# Altium project Phantom_Platform.PrjPcb (part 1 of 2)
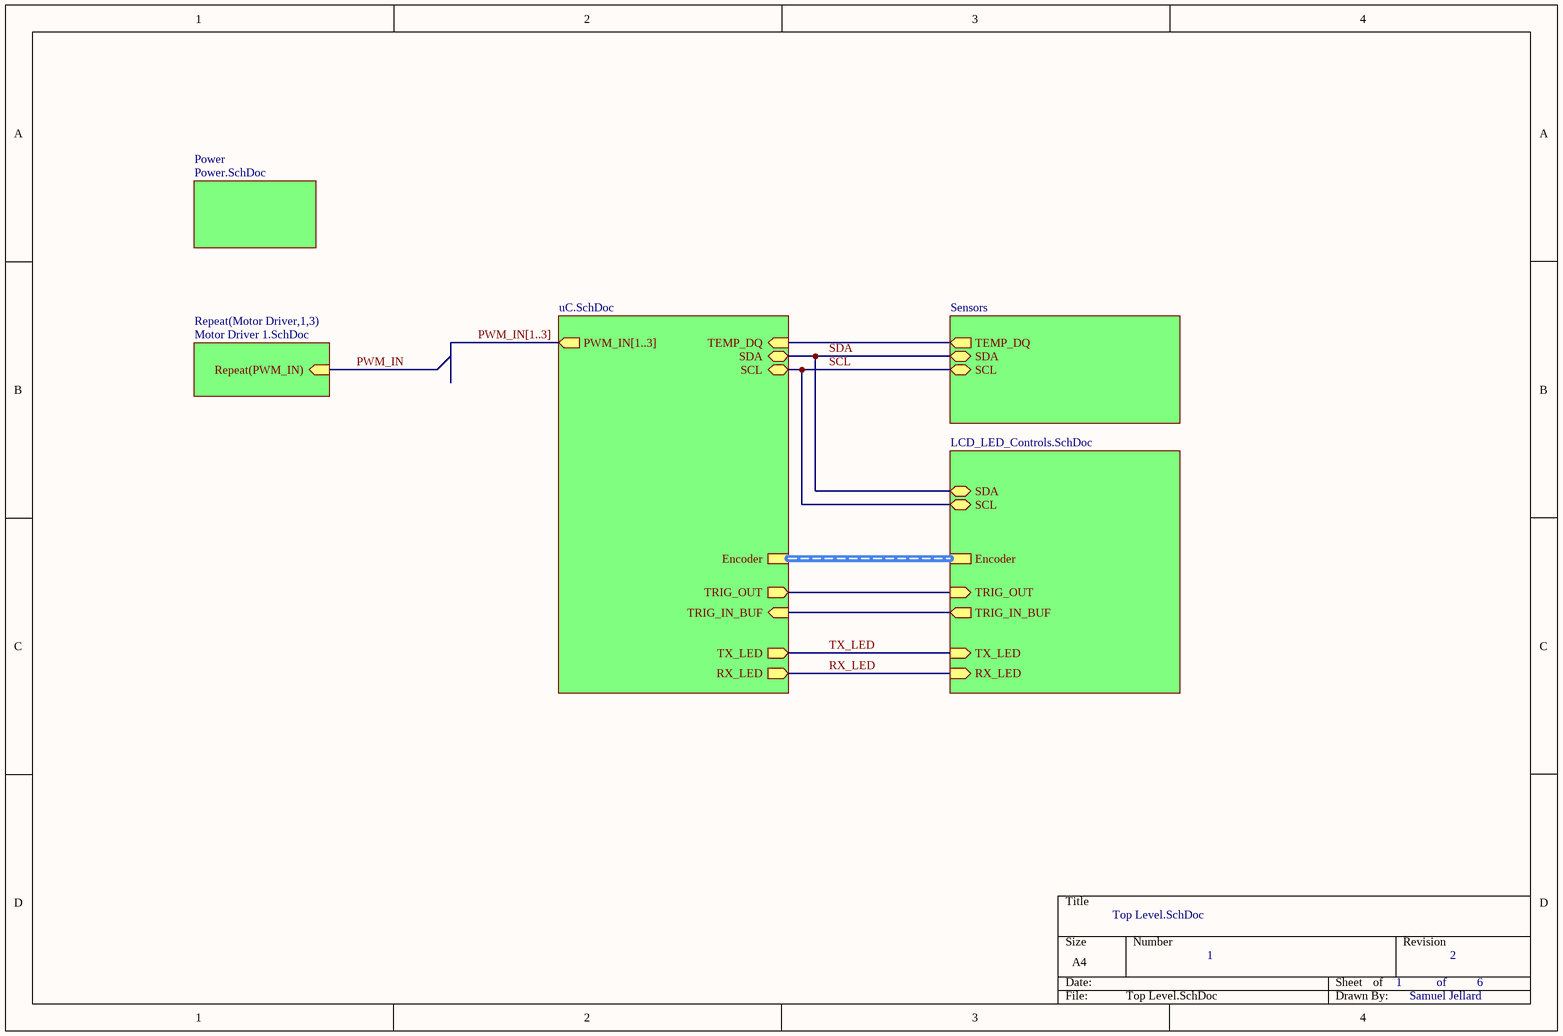
[diagram p0: Top Level.SchDoc]
6 sheets, 152 parts. Net scope: hierarchical (ports join the sheet entries above them; power ports are global).
Board file: PCB_V2.PcbDoc
Sheets:
  Top Level.SchDoc
    uC = uC.SchDoc
    Sensors = Sensors.SchDoc
    Designator = LCD_LED_Controls.SchDoc
    Power = Power.SchDoc
    Motor Driver1 = Motor Driver 1.SchDoc
    Motor Driver2 = Motor Driver 1.SchDoc
    Motor Driver3 = Motor Driver 1.SchDoc

## Sheet Top Level.SchDoc: Top Level
size A4; DocumentNumber: 1; Revision: 2; SheetNumber: 1; SheetTotal: 6

### Sub-sheets
Designator = LCD_LED_Controls.SchDoc: SDA (bidir), SCL (bidir), TX_LED (in), RX_LED (in), Encoder (harness *), TRIG_OUT (in), TRIG_IN_BUF (out)
Power = Power.SchDoc: no entries
Repeat(Motor Driver,1,3) = Motor Driver 1.SchDoc: Repeat(PWM_IN) (in)
Sensors = Sensors.SchDoc: SDA (bidir), SCL (bidir), TEMP_DQ (out)
uC = uC.SchDoc: SDA (bidir), SCL (bidir), RX_LED (out), TX_LED (out), PWM_IN[1..3] (out), TEMP_DQ (in), Encoder (harness *), TRIG_OUT (out), TRIG_IN_BUF (in)

### Nets
PWM_IN: sheet Repeat(Motor Driver,1,3)/Repeat(PWM_IN)
RX_LED: sheet uC/RX_LED, sheet Designator/RX_LED
SCL: sheet uC/SCL, sheet Sensors/SCL, sheet Designator/SCL
SDA: sheet uC/SDA, sheet Sensors/SDA, sheet Designator/SDA
TEMP_DQ: sheet uC/TEMP_DQ, sheet Sensors/TEMP_DQ
TRIG_IN_BUF: sheet uC/TRIG_IN_BUF, sheet Designator/TRIG_IN_BUF
TRIG_OUT: sheet uC/TRIG_OUT, sheet Designator/TRIG_OUT
TX_LED: sheet uC/TX_LED, sheet Designator/TX_LED

### Buses and harness runs
bus PWM_IN[1..3] = sheet uC/PWM_IN[1..3]
harness sheet Designator/Encoder = sheet uC/Encoder

### Notes on the sheet
- of
- Samuel Jellard

## Sheet uC.SchDoc
size A3; SheetNumber: 2; SheetTotal: 6
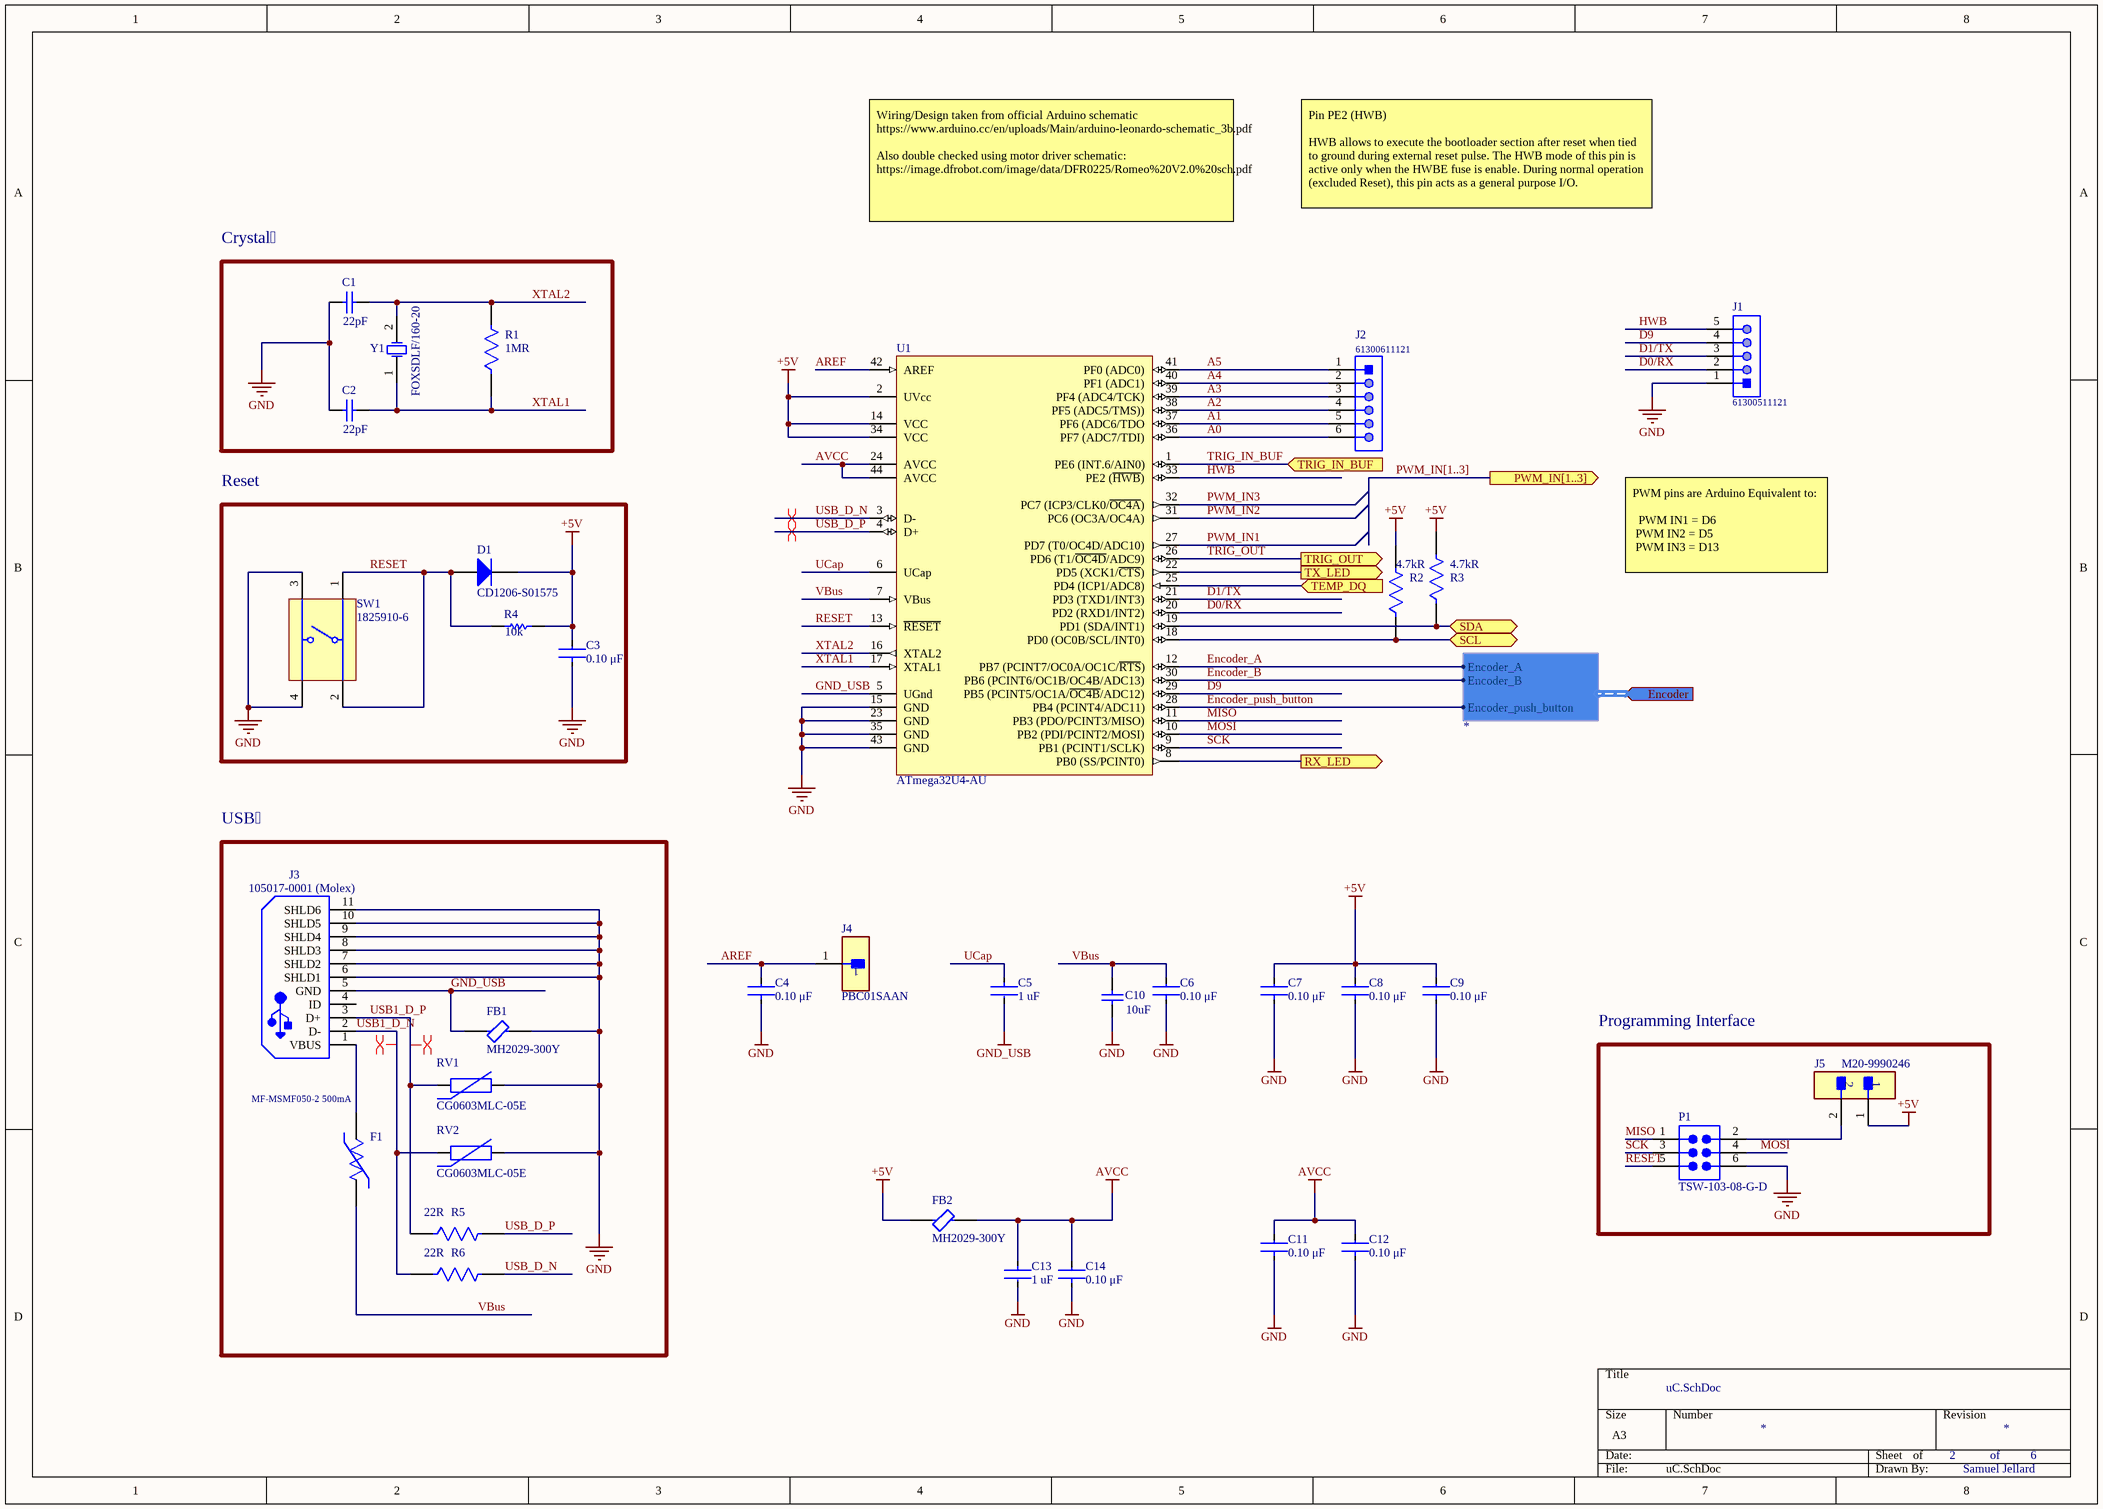
[diagram p1: uC.SchDoc]

### Parts
C1  CC0603JRNPO9BN220  [CAPC1608X90X40LL10T20]  (value not drawn)
C2  CC0603JRNPO9BN220  [CAPC1608X90X40LL10T20]  (value not drawn)
C3  value 0.10 μF  [FP-C0603C-CF-MFG]  (hidden comment: C0603C104K5RACTU)
C4  value 0.10 μF  [FP-C0603C-CF-MFG]  (hidden comment: C0603C104K5RACTU)
C5  value 1 uF  [FP-CC0603-DA-MFG]  (hidden comment: CC0603KRX7R7BB105)
C6  value 0.10 μF  [FP-C0603C-CF-MFG]  (hidden comment: C0603C104K5RACTU)
C7  value 0.10 μF  [FP-C0603C-CF-MFG]  (hidden comment: C0603C104K5RACTU)
C8  value 0.10 μF  [FP-C0603C-CF-MFG]  (hidden comment: C0603C104K5RACTU)
C9  value 0.10 μF  [FP-C0603C-CF-MFG]  (hidden comment: C0603C104K5RACTU)
C10  value 10uF  [CAPC0603(1608)100_N]  (hidden comment: C0603C106M9PACTU)
C11  value 0.10 μF  [FP-C0603C-CF-MFG]  (hidden comment: C0603C104K5RACTU)
C12  value 0.10 μF  [FP-C0603C-CF-MFG]  (hidden comment: C0603C104K5RACTU)
C13  value 1 uF  [FP-CC0603-DA-MFG]  (hidden comment: CC0603KRX7R7BB105)
C14  value 0.10 μF  [FP-C0603C-CF-MFG]  (hidden comment: C0603C104K5RACTU)
D1  CD1206-S01575  [BOUR-CD1206-S01575-2_L]
F1  MF-MSMF050-2 500mA  [FP-MF-MSMF050-2-MFG]
FB1  MH2029-300Y  [FP-MH2029-MFG]
FB2  MH2029-300Y  [FP-MH2029-MFG]
J1  61300511121  [61300511121]
J2  61300611121  [61300611121]
J3  105017-0001 (Molex)  [USB-MICRO-B_V]
J4  PBC01SAAN  [FP-PBC01SAAN-MFG]
J5  M20-9990246  [FP-M20-9990246-MFG]
P1  TSW-103-08-G-D  [SMTC-TSW-103-08-X-D]
R1  Resistance: 1MR  [FP-CRCW0603-e3-MFG]  (hidden comment: CRCW06031M00FKEA)
R2  Resistance: 4.7kR  [FP-CRCW0603-e3-IPC_A]  (hidden comment: CRCW06034K70FKEA)
R3  Resistance: 4.7kR  [FP-CRCW0603-e3-IPC_A]  (hidden comment: CRCW06034K70FKEA)
R4  CRCW060310K0FKEA  [RESC1609X50X30NL8T20]  (value not drawn)
R5  Resistance: 22R  [FP-CRCW0603-e3-IPC_B]  (hidden comment: CRCW060322R0FKEA)
R6  Resistance: 22R  [FP-CRCW0603-e3-IPC_B]  (hidden comment: CRCW060322R0FKEA)
RV1  CG0603MLC-05E  [BOUR-CG0603-2_V]
RV2  CG0603MLC-05E  [BOUR-CG0603-2_V]
SW1  1825910-6  [TECO-1825910-6_V]
U1  ATmega32U4-AU  [44ML_M]
Y1  FOXSDLF/160-20  [FOX-FOXSDLF160-20_V]

### Blocks framed on the sheet
Crystal: C1 C2 R1 Y1
Reset: C3 D1 R4 SW1
USB: F1 FB1 J3 R5 R6 RV1 RV2
Programming Interface: J5 P1

### Ports
Encoder (in, harness *), PWM_IN[1..3] (out), RX_LED (out), SCL (bidir), SDA (bidir), TEMP_DQ (in), TRIG_IN_BUF (in), TRIG_OUT (out), TX_LED (out)

### Harnesses
*: Encoder_A, Encoder_B, Encoder_push_button

### Nets
+5V: C3.2 C7.2 C8.2 C9.2 D1.2(K) FB2.2 J5.1 R2.2 R3.2 R4.2 U1.2(UVcc) U1.14(VCC) U1.34(VCC)
AVCC: C11.2 C12.2 C13.1 C14.2 FB2.1 U1.24(AVCC) U1.44(AVCC)
GND: C1.1 C2.1 C3.1 C4.1 C6.1 C7.1 C8.1 C9.1 C10.1 C11.1 C12.1 C13.2 C14.1 FB1.2 J1.1 J3.6(SHLD1) J3.7(SHLD2) J3.8(SHLD3) J3.9(SHLD4) J3.10(SHLD5) J3.11(SHLD6) P1.6 RV1.2 RV2.2 SW1.3 SW1.4 U1.15(GND) U1.23(GND) U1.35(GND) U1.43(GND)
GND_USB: C5.2 FB1.1 J3.5(GND) U1.5(UGnd)
A0: J2.6 U1.36(PF7_(ADC7/TDI))
A1: J2.5 U1.37(PF6_(ADC6/TDO)
A2: J2.4 U1.38(PF5_(ADC5/TMS)))
A3: J2.3 U1.39(PF4_(ADC4/TCK))
A4: J2.2 U1.40(PF1_(ADC1))
A5: J2.1 U1.41(PF0_(ADC0))
AREF: C4.2 J4.1 U1.42(AREF)
D0/RX: J1.2 U1.20(PD2_(RXD1/INT2))
D1/TX: J1.3 U1.21(PD3_(TXD1/INT3))
D9: J1.4 U1.29(PB5_(PCINT5/OC1A/~{OC4B}/ADC12))
Encoder_A: U1.12(PB7_(PCINT7/OC0A/OC1C/~{RTS})) ; port Encoder.Encoder_A
Encoder_B: U1.30(PB6_(PCINT6/OC1B/OC4B/ADC13)) ; port Encoder.Encoder_B
Encoder_push_button: U1.28(PB4_(PCINT4/ADC11)) ; port Encoder.Encoder_push_button
HWB: J1.5 U1.33(PE2_(~{HWB}))
MISO: P1.1 U1.11(PB3_(PDO/PCINT3/MISO))
MOSI: P1.4 U1.10(PB2_(PDI/PCINT2/MOSI))
PWM_IN1: U1.27(PD7_(T0/OC4D/ADC10))  [project net PWM_IN]
PWM_IN2: U1.31(PC6_(OC3A/OC4A))  [project net PWM_IN]
PWM_IN3: U1.32(PC7_(ICP3/CLK0/~{OC4A}))  [project net PWM_IN]
RESET: D1.1(A) P1.5 R4.1 SW1.1 SW1.2 U1.13(~{RESET})
RX_LED: U1.8(PB0_(SS/PCINT0)) ; port RX_LED
SCK: P1.3 U1.9(PB1_(PCINT1/SCLK))
SCL: R2.1 U1.18(PD0_(OC0B/SCL/INT0)) ; port SCL
SDA: R3.1 U1.19(PD1_(SDA/INT1)) ; port SDA
TEMP_DQ: U1.25(PD4_(ICP1/ADC8)) ; port TEMP_DQ
TRIG_IN_BUF: U1.1(PE6_(INT.6/AIN0)) ; port TRIG_IN_BUF
TRIG_OUT: U1.26(PD6_(T1/~{OC4D}/ADC9)) ; port TRIG_OUT
TX_LED: U1.22(PD5_(XCK1/~{CTS})) ; port TX_LED
UCap: C5.1 U1.6(UCap)
USB1_D_N: J3.2(D-) R6.1 RV2.1
USB1_D_P: J3.3(D+) R5.1 RV1.1
USB_D_N: R6.2 U1.3(D-)
USB_D_P: R5.2 U1.4(D+)
VBus: C6.2 C10.2 F1.2 U1.7(VBus)
XTAL1: C2.2 R1.1 U1.17(XTAL1) Y1.1(X1)
XTAL2: C1.2 R1.2 U1.16(XTAL2) Y1.2(X2)
NetF1_1: F1.1 J3.1(VBUS)
NetJ5_2: J5.2 P1.2

Not connected (* = marked no-connect by the designer): J3 4(ID)

### Buses and harness runs
bus PWM_IN[1..3] = port PWM_IN[1..3]

### Layout directives
differential pair: USB1_D_N, USB_D_N, USB_D_P
differential pair; net class *: USB1_D_P

### Notes on the sheet
- Wiring/Design taken from official Arduino schematic     https://www.arduino.cc/en/uploads/Main/arduino-leonardo-schematic_3b.pdf
  Also double checked using motor driver schematic: https://image.dfrobot.com/image/data/DFR0225/Romeo%20V2.0%20sch.pdf
- Pin PE2 (HWB)
  HWB allows to execute the bootloader section after reset when tied to ground during external reset pulse. The HWB mode of this pin is active only when the HWBE fuse is enable. During normal operation (excluded Reset), this pin acts as a general purpose I/O.
- (near C1) 22pF
- (near C2) 22pF
- PWM pins are Arduino Equivalent to:
  PWM IN1 = D6
  PWM IN2 = D5
  PWM IN3 = D13
- (near R4) 10k
- of
- Samuel Jellard

### Library data of the parts
C1 C2 = CMP-1659-00026-1: Chip Capacitor, 22 pF, +/- 5%, 50 V, -55 to 125 degC, 0603 (1608 Metric), RoHS, Tape and Reel; ComponentLink1URL: http://www.yageo.com/; PackageReference: 0603; ComponentLink1Description: Manufacturer URL; PackageDescription: 2-Pin Surface Mount Device, Body 1.6 x 0.8 mm; DatasheetVersion: Rev. 8, 08/2011; ComponentLink2Description: Datasheet; ComponentLink2URL: http://www.yageo.com/documents/recent/UPY-GP_NP0_16V-to-50V_8.pdf
C3 C4 C6-C9 C11 C12 C14 = CMP-2006-03061-2: Multilayer Ceramic Capacitors (MLCC) - SMD/SMT 50volts 0.1uF X7R 10%; Manufacturer: KEMET; Tolerance: 0.1; Temperature Coefficient: 30ppm/°C; Automotive Grade: Grade 1; Voltage Rating: 50 V; Temperature: -55°C to +125°C; RoHS: TRUE; Material: Ceramic; Temperature Range High: +125°C; Lead Free: Yes; Octopart: https://octopart.com/c0603c104k5ractu-kemet-139244; Digikey Description: CAP CER 0.1UF 50V X7R 0603; Category: Cap; Package: C0603C-CF; ComponentLink2Description: Datasheet; Temperature Range Low: -55°C; Device Class L1: Passive Components; Automotive: Yes; Device Class L3: Ceramic Capacitors; ComponentLink2URL: https://api.kemet.com/component-edge/download/datasheet/C0603C100J5GACAUTO.pdf; Capacitance: 0.10 μF; Device Class L2: Capacitors; Manufacturer Part Number: C0603C104K5RACTU; Temperature Characteristic: X7R; Height: 0.87mm
C5 C13 = CMP-03422-000924-1: 0603 1 uF 16 V ±10 % Tolerance X7R SMT Multilayer Ceramic Capacitor; Manufacturer: YAGEO; Tolerance: 0.1; Temperature Coefficient: 15%; Voltage: 16 V; Package: CC0603-DA; RoHS: TRUE; Device Class L2: Capacitors; Temperature Characteristic: X7R; Temperature: -55°C to +125°C; Temperature Range Low: -55°C; Automotive: No; ComponentLink2Description: Datasheet; Lead Free: Yes; Capacitance: 1 uF; ComponentLink2URL: http://www.yageo.com/documents/recent/UPY-GPHC_X7R_6.3V-to-50V_18.pdf; Device Class L1: Passive Components; Octopart: https://octopart.com/cc0603krx7r7bb105-yageo-42271928; Category: Cap; Digikey Description: CAP CER 1UF 16V X7R 0603; Footprint Url: http://www.yageo.com/exep/pages/download/literatures/UPY-C_GEN_24.pdf; Height: 0.9mm; Manufacturer Part Number: CC0603KRX7R7BB105; Material: Ceramic; Voltage Rating: 16 V; Temperature Range High: +125°C; Mouser Description: Multilayer Ceramic Capacitor, CC Series, 1 - F, - 10%, X7R, 16 V, 0603 [1608 Metric]; Device Class L3: Ceramic Capacitors
C10 = CMP-1035-02797-1: CAP 10uF 6.3V ±20% 0603 (1608 Metric) Thickness 1mm SMD; Case-Metric: 1608; Case-EIA: 0603; Tolerance: Â±20%; Technology: SMT; Max Thickness: 1 mm; Rated Voltage: 6.3 V
D1 = CMP-0583-00001-2: 75 V Small Signal Switching Diode, 150 mA, 2.5 uA, 1026 Molded Package, RoHS, Tape and Reel; Manufacturer: Bourns; Reverse Voltage: 75 V; Average Forward Current: 150 mA; Reverse Current (Max.): 2.5 uA; Capacitance Between Terminals (Max.): 3 pF; Reverse Recovery Time (Max.): 4 nS; Forward Voltage (Max.): 1.00 V; Packing: Tape and Reel; Mounting Technology: Surface Mount; DatasheetVersion: Rev. 06/11; ComponentLink2URL: http://www.bourns.com/data/global/pdfs/CD1206_S01575.pdf; PackageReference: CD1206-S01575-2; RoHS: TRUE; ComponentLink1URL: http://www.bourns.com/; ComponentLink1Description: Manufacturer URL; ComponentLink3Description: Package Specification; ComponentLink3URL: http://www.bourns.com/data/global/pdfs/CD1206_S01575.pdf; ComponentLink2Description: Datasheet; PackageDescription: 2-Pin SMD, Body 3.2 x 1.5 mm; PartNumber: CD1206-S01575
F1 = CMP-2100-03653-2: PTC RESET FUSE 15V 500MA 1812; Manufacturer: Bourns; Value: 0.15-1Ω; Trip Current: 1A; Automotive Grade: Grade 3; Trip Time: 0.15s; Current Rating: 100A; Hold Current: 0.5A; Height: 0.85mm; Package: 1812; Voltage Rating: 15V; Temperature Range High: +85°C; Device Class L2: PTC Resettable Fuses; Lead Free: Yes; ComponentLink2URL: http://www.bourns.com/docs/Product-Datasheets/mfmsmf.pdf; Ambient Temperature Range High: +85°C; Mouser Description: PTC Resettable Fuse 0.5A(hold) 1A(trip) 15V 100A 0.8W 0.15s 0.15Ohm SMD Solder Pad 1812 T/R; Digikey Description: PTC RESET FUSE 15V 500MA 1812; Manufacturer Part Number: MF-MSMF050-2; Resistance: 0.15-1Ω; Category: Fuse; ComponentLink2Description: Datasheet; Automotive: Yes; Temperature Range Low: -40°C; RoHS: TRUE; Device Class L1: Circuit Protection; Temperature: -40°C to +85°C; Octopart: https://octopart.com/mf-msmf050-2-bourns-28047; Ambient Temperature Range Low: -40°C; Device Class L3: unset
FB1 FB2 = CMP-07252-000001-1: FERRITE BEAD 30 OHM 0805 1LN; Manufacturer: Bourns; Series Resistance: 25mΩ; Resistance: 30Ω; Value: 30Ω; Impedance At Frequency: 30Ω @ 100MHz; Rms Current: 3A; Tolerance: 25%; RoHS: TRUE; Manufacturer Part Number: MH2029-300Y; Temperature Range High: +125°C; Device Class L3: Ferrite Beads and Chips; Core Material: Ferrite; ComponentLink2Description: Datasheet; Category: FBead; Octopart: https://octopart.com/mh2029-300y-bourns-756929; Digikey Description: FERRITE BEAD 30 OHM 0805 1LN; Device Class L2: EMI / RFI Components; Lead Free: Yes; Mouser Description: Ferrite Beads 30 ohms 25% HIGH CURRENT; Automotive: No; Ipc Land Pattern Name: CAPC200120X90; Temperature: -55°C to +125°C; Device Class L1: Passive Components; Height: 1.1mm; ComponentLink2URL: https://www.bourns.com/docs/Product-Datasheets/mh.pdf; Package: MH2029; Temperature Range Low: -55°C
J1 = CMP-1502-01068-1: THT Vertical Pin Header WR-PHD, Pitch 2.54 mm, Single Row, 5 pins; Manufacturer: Wurth Elektronik; Pin Number: 5; Contact Resistance: 20mOhm; Working Voltage: 250VAC; Pitch: 2.54mm; Withstanding Voltage: 500VAC; Rated Current: 3A; Gender: Male; Datasheet URL: https://katalog.we-online.de/em/datasheet/6130xx11121.pdf; Orientation: Vertical; Mounting Technology: THT; Row Number: Single; Package Reference: 61300511121; Publisher: WurthElektronik; Part Number: 61300511121; Packaging: Bag; Manufacturer URL: http://www.we-online.de; Operating Temperature: -40to105degC
J2 = CMP-1502-01070-1: THT Vertical Pin Header WR-PHD, Pitch 2.54 mm, Single Row, 6 pins; Manufacturer: Wurth Elektronik; Gender: Male; Pin Number: 6; Pitch: 2.54mm; Working Voltage: 250VAC; Rated Current: 3A; Withstanding Voltage: 500VAC; Contact Resistance: 20mOhm; Operating Temperature: -40to105degC; Packaging: Bag; Datasheet URL: https://katalog.we-online.de/em/datasheet/6130xx11121.pdf; Package Reference: 61300611121; Mounting Technology: THT; Publisher: WurthElektronik; Part Number: 61300611121; Manufacturer URL: http://www.we-online.de; Row Number: Single; Orientation: Vertical
J3 = CMP-2000-05827-1: Micro-USB B Receptacle, Right Angle, Bottom Mount, Surface Mount, with Solder Tabs, -30 to 85 degC, 5-Pin USB, RoHS, Tape and Reel; Featured Product: Micro-USBConnectorsUSBConnectors; Other Names: WM1399DKR; Package Version: Rev. F, 12/2012; Number of Contacts: 5; Connector Type: USB-microB; Catalog Drawings: 1050170001; 3D Model: 105017-0001.stp; Mating Products: WM17145-ND-CABLEMICROUSBBTOSTDA1.0MWM17147-ND-CABLEMICROUSBBTOSTDA2.0MWM17146-ND-CABLEMICROUSBBTOSTDA1.5M; PCN Assembly/Origin: ResinSupplier21/Oct/2015; Voltage - Max: 30V; Online Catalog: Molex-MicroUSB; Manufacturer URL: http://www.molex.com/; Package Description: 5-Leads USB, Micro B, Body 7.5 x 5 mm, Pitch 0.65 mm; Datasheet URL: http://www.molex.com/elqNow/elqRedir.htm?ref=http://www.molex.com/webdocs/datasheets/pdf/en-us/1050170001_IO_CONNECTORS.pdf; Ingress Protection: -; Datasheet Version: 03/2016; Mounting Type: BoardCutout,SurfaceMount,RightAngle; Circuits: 5; Standard Package: 1; Package Reference: MICRO-B; Manufacturer: Molex; Package URL: http://www.molex.com/pdm_docs/sd/1050170001_sd.pdf; Category: Connectors,Interconnects; Series: -; RoHS Information: 1050170001CertofCompliance; Features: Shielded,SolderRetention; Family: USB,DVI,HDMIConnectors; Specifications: -; Gender: Receptacle; Packaging: Digi-Reel®; Mounting Technology: SurfaceMount
J4 = CMP-25680-000032-1: CONN HEADER VERT 1POS; Number of Positions: 1; Connector Type: Male Pin; Gender: Male; Pitch: 2.54mm; Contact Material: Bronze; Mount: Through Hole; Length: 2.54mm; Height: 2.54mm; Lead Free: Lead Free; Number of Rows: 1; Contact Plating: Gold; Number of Contacts: 1; Housing Material: Plastic; Termination: Solder; Package Quantity: 1; Packaging: Bulk; Color: Black; Contact Mating Length: 0.23inch; Housing Color: Black; Width: 2.54mm
J5 = CMP-15831-000009-1: 2.54mm (0.1") Pitch SIL Vertical PC Tail Pin Header, 6.1mm mating pin height, tin, 2 contacts; Manufacturer: Harwin; Conn Gender: Male; Number Of Contacts: 2; Current Rating: 3A; ComponentLink2URL: https://cdn.harwin.com/pdfs/M20-999.pdf; ComponentLink2Description: Datasheet; Package: M20-9990246; Temperature: -40°C to +105°C; Octopart: https://octopart.com/m20-9990246-harwin-2590635; Mouser Description: 2.54mm (0.1") Pitch SIL Vertical PC Tail Pin Header, 6.1mm mating pin height, tin, 2 contacts; Temperature Range High: +105°C; Device Class L1: Connectors; Conn Orientation: Vertical; RoHS: TRUE; Automotive: No; Height: 8.99mm; Number Of Rows: 1; Contact Material: Tin,Nickel; Category: Conn; Pitch: 2.54mm; Lead Free: Yes; Digikey Description: CONN HEADER VERT 2POS 2.54MM; Manufacturer Part Number: M20-9990246; Temperature Range Low: -40°C; Device Class L3: unset; Device Class L2: Headers and Wire Housings
P1 = CMP-1024-00338-1: 0.025" SQ Post Header, Through-hole, Vertical, -55 to 125 degC, 2.54 mm Pitch, 6-Pin, Male, RoHS; Manufacturer: Samtec; Pitch: 2.54 mm; ComponentLink1URL: http://www.samtec.com; ComponentLink2URL: http://www.samtec.com/documents/webfiles/pdf/TSW_TH.PDF; Temperature Range: -55 to 125 degC; RoHS: True; ComponentLink2Description: Datasheet; PackageReference: TSW-103-08-X-D; ComponentLink3Description: Package Specification; PackageDescription: .025[0.64] SQ. Post Terminal Strip Assembly; DatasheetVersion: F-214; Mounting Technology: Through-hole; ComponentLink1Description: Manufacturer URL; Orientation: Vertical; PartNumber: TSW-103-08-G-D; PackageVersion: DM, 8/1988; ComponentLink3URL: http://www.samtec.com/documents/webfiles/cpdf/TSW-XXX-XX-XXX-X-XX-XXX-MKT.pdf
R1 = CMP-2000-03013-2: RES Thick Film, 1MΩ, 1%, 0.1W, 100ppm/°C, 0603; Max Power Dissipation: 100mW; Voltage Rating (DC): 75V; Depth: 0.85mm; Max Operating Temperature: 155°C; Length: 1.55mm; Power Rating: 100mW; Military Standard: Not; Features: Automotive AEC-Q200; Min Operating Temperature: -55°C; Number of Pins: 2; Mount: Surface Mount; Package Quantity: 10; Packaging: Tape and Reel; Height: 0.45mm; Radiation Hardening: No; Case Code (Metric): 1608; Temperature Coefficient: 100ppm/°C; Width: 0.85mm; Composition: Thick Film; Termination: SMD/SMT; Tolerance: 1%; Number of Terminations: 2; Lead Free: Lead Free; Contact Plating: Tin; Case/Package: 0603; Weight: 7.1E-05oz; Voltage Rating: 75V; Case Code (Imperial): 0603
R2 R3 = CMP-1666-00019-3: RES Thick Film, 4.7kΩ, 1%, 0.1W, 100ppm/°C, 0603; Voltage Rating: 75V; Power Rating: 100mW; Case Code (Metric): 1608; Military Standard: Not; Packaging: Tape and Reel; Termination: SMD/SMT; Temperature Coefficient: 100ppm/°C; Lead Free: Lead Free; Length: 1.55mm; Width: 0.85mm; Height: 0.45mm; Depth: 0.85mm; Weight: 7.1E-05oz; Case Code (Imperial): 0603; Contact Plating: Tin; Case/Package: 0603; Max Operating Temperature: 155°C; Mount: Surface Mount; Tolerance: 1%; Min Operating Temperature: -55°C; Package Quantity: 5000; Voltage Rating (DC): 75V; Composition: Thick Film
R4 = CMP-1666-00005-4: Chip Resistor, 10 KOhm, +/- 1%, 100 mW, -55 to 155 degC, 0603 (1608 Metric), RoHS, Tape and Reel; Manufacturer: Vishay Semiconductor; Voltage Rating: 75 V; Max Operating Temperature: 155 degC; PackageDescription: 2-Pin Surface Mount Device, Body 1.575 x 0.85 mm; ComponentLink1Description: Manufacturer URL; RoHSCompliant: true; PackageReference: 0603; REACH SVHC: Unknown; Length: 1.55 mm; DatasheetVersion: 06/2012; Packaging: Tape and Reel; Min Operating Temperature: -55 degC; Mounting Technology: Surface Mount; ComponentLink2URL: https://datasheet.ciiva.com/11809/0900766b80d98afc-11809037.pdf; Height: 0.45 mm; ComponentLink2Description: Datasheet; Package Quantity: 5000; ComponentLink1URL: http://www.vishay.com/
R5 R6 = CMP-2000-03097-2: RES Thick Film, 22Ω, 1%, 0.1W, 100ppm/°C, 0603; Voltage Rating: 75V; Power Rating: 100mW; Lead Free: Lead Free; Height: 0.45mm; Package Quantity: 5000; Weight: 7.1E-05oz; Width: 0.85mm; Length: 1.55mm; Mount: Surface Mount; Packaging: Tape and Reel; Termination: SMD/SMT; Temperature Coefficient: 100ppm/°C; Case/Package: 0603; Case Code (Metric): 1608; Radiation Hardening: No; Max Operating Temperature: 155°C; Military Standard: Not; Min Operating Temperature: -55°C; Case Code (Imperial): 0603; Contact Plating: Tin; Voltage Rating (DC): 75V; Tolerance: 1%; Depth: 0.85mm; Composition: Thick Film
RV1 RV2 = CMP-0584-00001-2: ESD Protector, 5 V Supply, -40 to 85 degC, 1.6 x 0.8 x 0.55 mm SMD, RoHS, Tape and Reel; Manufacturer: Bourns; VC: 20 V; VT: 150 V; RT: 1 ns; VDC: 5 V; CO: 0.5 pF; PartNumber: CG0603MLC-05E; ComponentLink1Description: Manufacturer URL; ComponentLink1URL: http://www.bourns.com/; Packing: Tape and Reel; Mounting Technology: Surface Mount; ComponentLink2Description: Datasheet; RoHS: TRUE; Operating Temperature: -40 to 85 degC; DatasheetVersion: Rev. S; PackageDescription: 2-Pin SMD, Body 1.6 x 0.8 mm, Pitch 1.52 mm; PackageReference: CG0603-2; ComponentLink2URL: http://www.bourns.com/data/global/pdfs/MLC.pdf
SW1 = CMP-1684-00021-1: Tact Switch, SPST-NO, 0.05 A, -35 to 85 degC, 4-Pin THD, RoHS, Bulk; Manufacturer: TE Connectivity; Maximum Contact Resistance: 100mOhm; Mechanical Life: 100000Cycles; Bushing Type: Unthreaded; Switch Configuration: OFF(ON); Maximum DC Voltage Rating: 24V; Contact Rating @ Voltage: 0.05A@24VDC; Actuator Color: Black; Body Orientation: Straight; Function: MomentaryContact; Illumination: N/R; Actuator Style: RoundButton; Actuator Material: PolybutyleneTerephthalate; Dielectric Strength: 500VAC; Pole Throw Configuration: SPST; Actuator Length: 1.4mm; Product Weight: N/A; Contact Material: CopperAlloy; Housing Material: N/A; Terminal Type: PCPins; Minimum Insulation Resistance: 100MOhm; Package Description: 4-Pin Through Hole Device, Body 5.99 x 5.99 mm, Pitch 6.5 mm; Part No: 1825910-6; Package Reference: THD; Base Material: N/A; Manufacturer URL: http://www.te.com; Contact Plating: Silver; RoHS: Yes; Datasheet Version: Rev. C9; Electrical Life: 100000Cycles; Maximum AC Voltage Rating: N/A; Thread Size: N/R; Operating Temperature: -35to85C; Mounting: ThroughHole; Dimension: 5.99x5mm; Datasheet URL: http://www.te.com/commerce/DocumentDelivery/DDEController?Action=showdoc&DocId=Customer+Drawing%7F1825910%7FC9%7Fpdf%7FEnglish%7FENG_CD_1825910_C9.pdf%7F1825910-6; Family: 1825910; Seal Location: N/A; Seal Description: N/A; Packaging: N/A
U1 = CMP-0095-00285-2: 8-bit AVR Microcontroller, 2.7-5.5V, 16MHz, 32KB Flash, 1KB EEPROM, 2.5KB SRAM, USB Controller, 44-pin TQFP, Industrial Grade (-40°C to 85°C), Ext Osc; RevisionNote: DatasheetVersion updated. URLs added.; ComponentLink1Description: Manufacturer URL; PackageDescription: 44-Pin Plastic Thin Quad Flat Pack, 10 x 10 x 1.0 mm Body, 0.8 mm Pitch (TQFP); DatasheetVersion: revF, Nov-2010; ComponentLink2URL: http://www.atmel.com/dyn/resources/prod_documents/doc7766.pdf; ComponentLink1URL: http://www.atmel.com/; PackageReference: 44ML; ComponentLink2Description: ATmega16U4/32U4 Datasheet; PackageVersion: rev.G, Jul-2007; ComponentLink3URL: http://www.atmel.com/dyn/resources/prod_documents/7766S.pdf; ComponentLink3Description: ATmega16U4 ATmega32U4 Summary
Y1 = CMP-1749-00001-1: Resistance Weld SMD Crystal, 16 MHz, +/- 30 ppm, 20 pF, -20 to 70 degC, 2-Pin SMD, RoHS, Tape and Reel; Output Current: 3 mA; Case\Package: SOT-553-6; Min Supply Voltage (DC): 4 V; Max Supply Voltage: 3.3 V; Min Supply Voltage: 1.4 V; Interface: I2C; Max Supply Voltage (DC): 6 V; ComponentLink2Description: Datasheet; REACH SVHC: No SVHC; ComponentLink1URL: http://www.foxonline.com/; ComponentLink2URL: http://foxonline.com/pdfs/hc49sdlf.pdf; Pins: 6; Packaging: Cut Tape; ComponentLink1Description: Manufacturer URL; Weight: 9.9E-05 oz; Length: 1.6 mm; RoHSCompliant: true; Min Operating Temperature: -55 degC; Radiation Hardening: No; PackageDescription: 2-Pin Surface Mount Device, Body 5 x 11.7 mm, Height 4.5 mm; Package Quantity: 1; Width: 1.2 mm; DatasheetVersion: Mar-15; Max Operating Temperature: 150 degC; Mount: Surface Mount; PackageReference: FOX-FOXSDLF160-20; Height: 0.55 mm

## Sheet Sensors.SchDoc
size A3; SheetNumber: 5; SheetTotal: 6
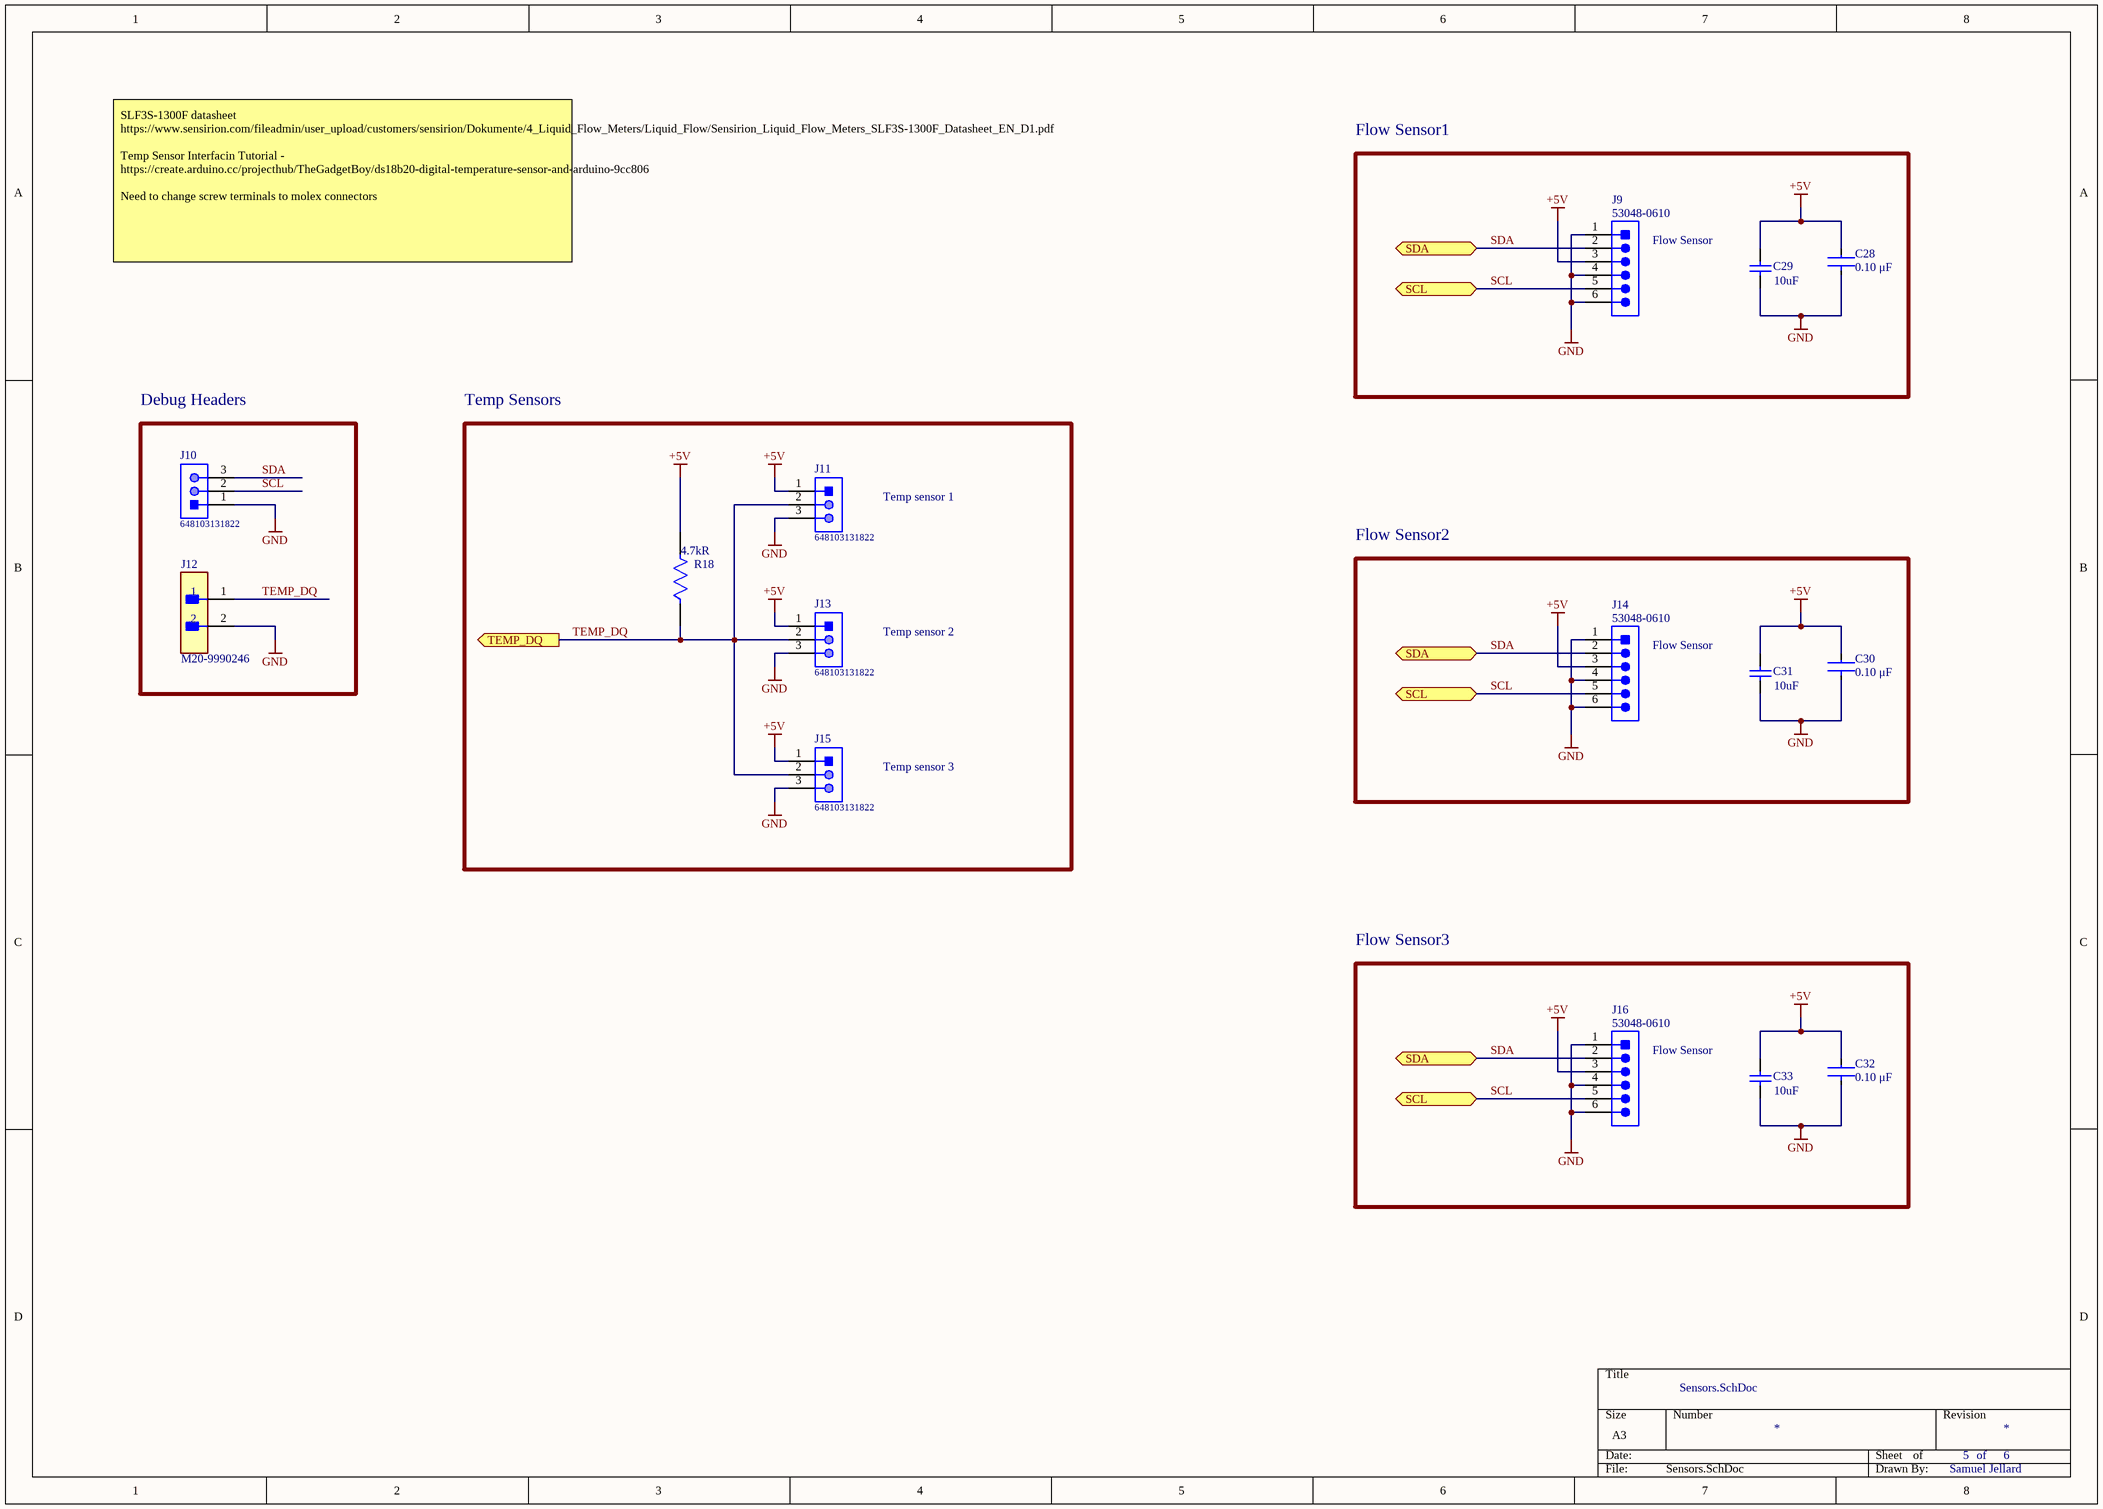
[diagram p2: Sensors.SchDoc]

### Parts
C28  value 0.10 μF  [FP-C0603C-CF-MFG]  (hidden comment: C0603C104K5RACTU)
C29  value 10uF  [CAPC0603(1608)100_N]  (hidden comment: C0603C106M9PACTU)
C30  value 0.10 μF  [FP-C0603C-CF-MFG]  (hidden comment: C0603C104K5RACTU)
C31  value 10uF  [CAPC0603(1608)100_N]  (hidden comment: C0603C106M9PACTU)
C32  value 0.10 μF  [FP-C0603C-CF-MFG]  (hidden comment: C0603C104K5RACTU)
C33  value 10uF  [CAPC0603(1608)100_N]  (hidden comment: C0603C106M9PACTU)
J9  53048-0610  [MOLX-53048-0610_V]
J10  648103131822  [648103131822]
J11  648103131822  [648103131822]
J12  M20-9990246  [FP-M20-9990246-MFG]
J13  648103131822  [648103131822]
J14  53048-0610  [MOLX-53048-0610_V]
J15  648103131822  [648103131822]
J16  53048-0610  [MOLX-53048-0610_V]
R18  Resistance: 4.7kR  [FP-CRCW0603-e3-IPC_A]  (hidden comment: CRCW06034K70FKEA)

### Blocks framed on the sheet
Flow Sensor1: C28 C29 J9
Debug Headers: J10 J12
Temp Sensors: J11 J13 J15 R18
Flow Sensor2: C30 C31 J14
Flow Sensor3: C32 C33 J16

### Ports
SCL (bidir), SDA (bidir), TEMP_DQ (out)

### Nets
+5V: C28.2 C29.2 C30.2 C31.2 C32.2 C33.2 J9.3 J11.1 J13.1 J14.3 J15.1 J16.3 R18.2
GND: C28.1 C29.1 C30.1 C31.1 C32.1 C33.1 J9.1 J9.4 J9.6 J10.1 J11.3 J12.2 J13.3 J14.1 J14.4 J14.6 J15.3 J16.1 J16.4 J16.6
SCL: J9.5 J10.2 J14.5 J16.5 ; port SCL
SDA: J9.2 J10.3 J14.2 J16.2 ; port SDA
TEMP_DQ: J11.2 J12.1 J13.2 J15.2 R18.1 ; port TEMP_DQ

### Notes on the sheet
- Flow Sensor
- SLF3S-1300F datasheet https://www.sensirion.com/fileadmin/user_upload/customers/sensirion/Dokumente/4_Liquid_Flow_Meters/Liquid_Flow/Sensirion_Liquid_Flow_Meters_SLF3S-1300F_Datasheet_EN_D1.pdf
  Temp Sensor Interfacin Tutorial - https://create.arduino.cc/projecthub/TheGadgetBoy/ds18b20-digital-temperature-sensor-and-arduino-9cc806
  Need to change screw terminals to molex connectors
- Temp sensor 1
- Temp sensor 2
- Temp sensor 3
- of
- Samuel Jellard

### Library data of the parts
C28 C30 C32 = CMP-2006-03061-2: as C3 on sheet uC; Temperature: -55°C to +125°C; RoHS: TRUE; Material: Ceramic; Temperature Range High: +125°C; Lead Free: Yes; Octopart: https://octopart.com/c0603c104k5ractu-kemet-139244; Digikey Description: CAP CER 0.1UF 50V X7R 0603; Category: Cap; Package: C0603C-CF; ComponentLink2Description: Datasheet; Temperature Range Low: -55°C; Device Class L1: Passive Components; Automotive: Yes; Device Class L3: Ceramic Capacitors; ComponentLink2URL: https://api.kemet.com/component-edge/download/datasheet/C0603C100J5GACAUTO.pdf; Capacitance: 0.10 μF; Device Class L2: Capacitors; Manufacturer Part Number: C0603C104K5RACTU; Temperature Characteristic: X7R; Height: 0.87mm
C29 C31 C33 = CMP-1035-02797-1: as C10 on sheet uC; Technology: SMT; Max Thickness: 1 mm; Rated Voltage: 6.3 V
J9 J14 J16 = CMP-2000-05632-1: Male Header, Pitch 1.25 mm, 1 x 6 Position, Height 3.5 mm, Tail Length 2.3 mm, -40 to 85 degC, RoHS, Tray; Manufacturer: Molex; Number of Positions / Contacts: 6; Pitch: 1.25mm; Mounting Angle: Right; Current Rating: 1A; Voltage Rating: 125V; RoHS: Details; Termination Style: ThroughHole; Type: Shrouded; Contact Plating: Tin; Number of Rows: 1; Product Type: Headers; Product Category: 1.25mmConnectors; Datasheet Version: 01/2002; Mounting Style: ThroughHole; Package Reference: 53048-0610; Brand: Molex; Package URL: http://www.molex.com/pdm_docs/sd/530480610_sd.pdf; Factory Pack Quantity: 2000; Number of Positions: 6; Housing Material: Nylon; Contact Material: PhosphorBronze; Datasheet URL: http://www.farnell.com/datasheets/307528.pdf; Mounting Technology: ThroughHole; Manufacturer URL: http://www.molex.com/; Tradename: PicoBlade; Packaging: Tray; Series: 53048; Package Description: Male Header, Pitch 1.25 mm, 1 x 6 Position, Height 3.5 mm, Tail Length 2.3 mm
J10 J11 J13 J15 = CMP-1502-00731-1: Male Shrouded Header WR-WTB, SMT, Right Angled, pitch 1.5 mm, 1 x 3 position; Manufacturer: Wurth Elektronik; Pitch: 1.5mm; Contact Resistance: 20mOhm; Position: 1x3; Working Voltage: 50VAC; Operating Temperature: -25to85degC; Orientation: RightAngled; Publisher: WurthElektronik; Mounting Technology: SMT; Manufacturer URL: http://www.we-online.de; Gender: Male; Datasheet URL: https://katalog.we-online.de/em/datasheet/6481xx131822.pdf; Package Reference: 648103131822; Part Number: 648103131822; Packaging: TapeandReel
J12 = CMP-15831-000009-1: as J5 on sheet uC; ComponentLink2URL: https://cdn.harwin.com/pdfs/M20-999.pdf; ComponentLink2Description: Datasheet; Package: M20-9990246; Temperature: -40°C to +105°C; Octopart: https://octopart.com/m20-9990246-harwin-2590635; Mouser Description: 2.54mm (0.1") Pitch SIL Vertical PC Tail Pin Header, 6.1mm mating pin height, tin, 2 contacts; Temperature Range High: +105°C; Device Class L1: Connectors; Conn Orientation: Vertical; RoHS: TRUE; Automotive: No; Height: 8.99mm; Number Of Rows: 1; Contact Material: Tin,Nickel; Category: Conn; Pitch: 2.54mm; Lead Free: Yes; Digikey Description: CONN HEADER VERT 2POS 2.54MM; Manufacturer Part Number: M20-9990246; Temperature Range Low: -40°C; Device Class L3: unset; Device Class L2: Headers and Wire Housings
R18 = CMP-1666-00019-3: as R2 on sheet uC; Case Code (Metric): 1608; Military Standard: Not; Packaging: Tape and Reel; Termination: SMD/SMT; Temperature Coefficient: 100ppm/°C; Lead Free: Lead Free; Length: 1.55mm; Width: 0.85mm; Height: 0.45mm; Depth: 0.85mm; Weight: 7.1E-05oz; Case Code (Imperial): 0603; Contact Plating: Tin; Case/Package: 0603; Max Operating Temperature: 155°C; Mount: Surface Mount; Tolerance: 1%; Min Operating Temperature: -55°C; Package Quantity: 5000; Voltage Rating (DC): 75V; Composition: Thick Film

## Sheet LCD_LED_Controls.SchDoc
size A4; SheetNumber: 4; SheetTotal: 6
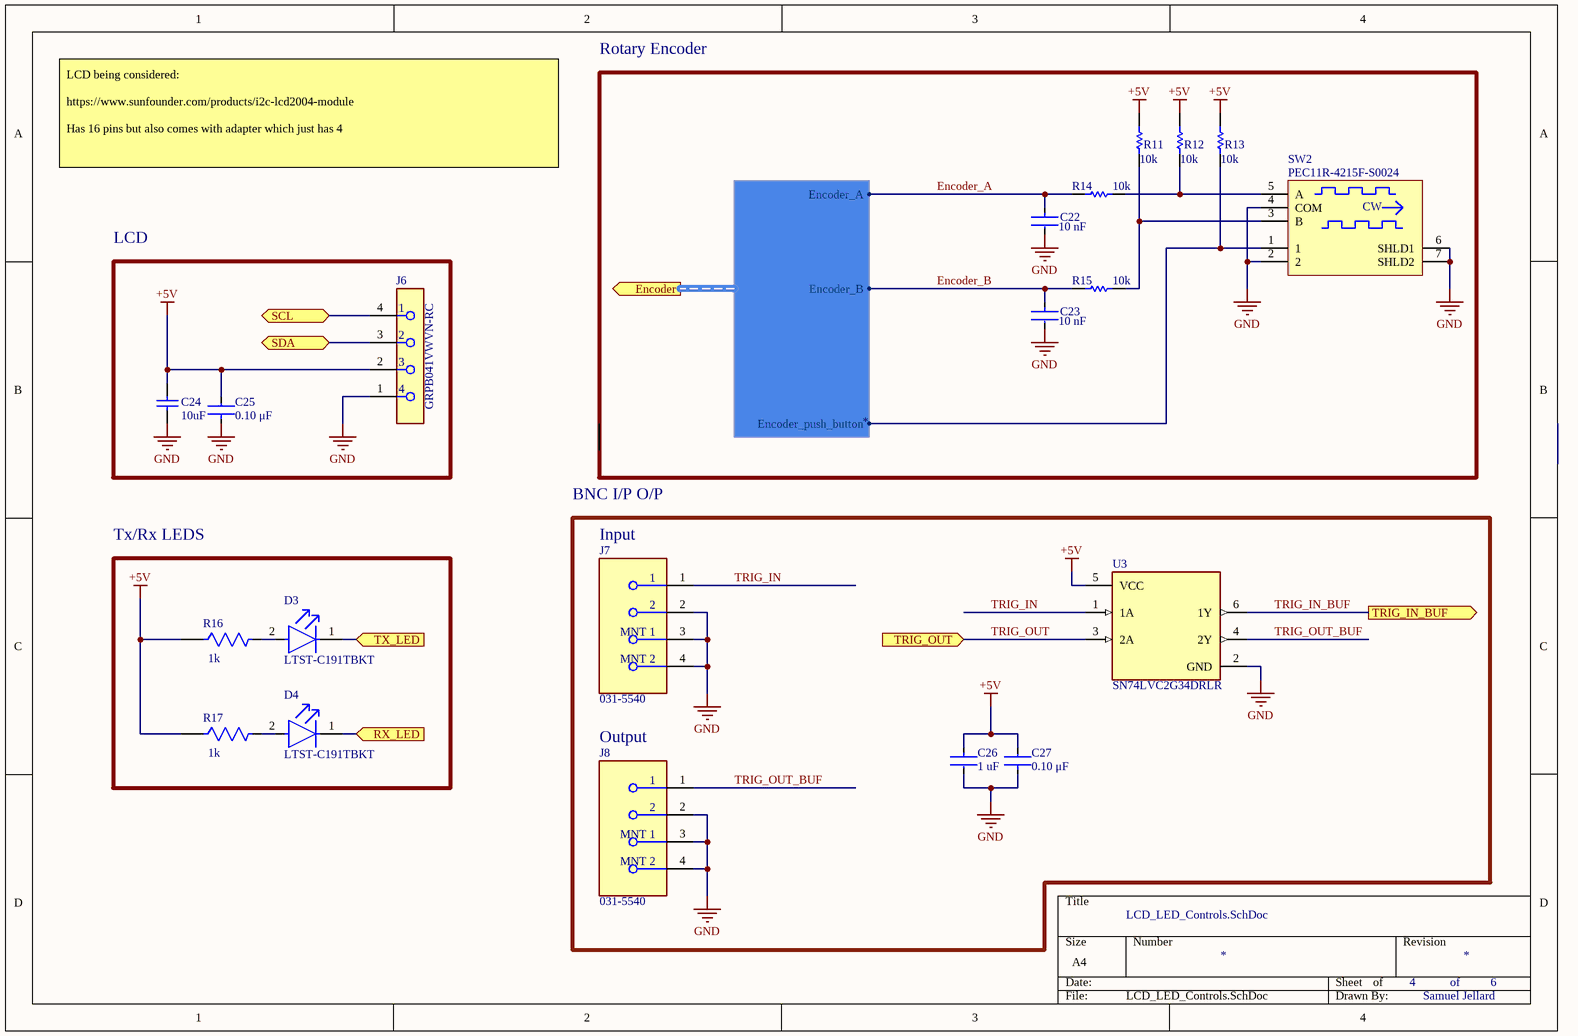
[diagram p3: LCD_LED_Controls.SchDoc]

### Parts
C22  value 10 nF  [FP-CC0603-DA-MFG]  (hidden comment: CC0603KRX7R8BB103)
C23  value 10 nF  [FP-CC0603-DA-MFG]  (hidden comment: CC0603KRX7R8BB103)
C24  value 10uF  [CAPC0603(1608)100_N]  (hidden comment: C0603C106M9PACTU)
C25  value 0.10 μF  [FP-C0603C-CF-MFG]  (hidden comment: C0603C104K5RACTU)
C26  value 1 uF  [FP-CC0603-DA-MFG]  (hidden comment: CC0603KRX7R7BB105)
C27  value 0.10 μF  [FP-C0603C-CF-MFG]  (hidden comment: C0603C104K5RACTU)
D3  LTST-C191TBKT  [FP-LTST-C191TBKT-MFG]
D4  LTST-C191TBKT  [FP-LTST-C191TBKT-MFG]
J6  GRPB041VWVN-RC  [LCD2004]
J7  031-5540  [FP-031-5540-MFG]
J8  031-5540  [FP-031-5540-MFG]
R11  CRCW060310K0FKEA  [RESC1609X50X30NL8T20]  (value not drawn)
R12  CRCW060310K0FKEA  [RESC1609X50X30NL8T20]  (value not drawn)
R13  CRCW060310K0FKEA  [RESC1609X50X30NL8T20]  (value not drawn)
R14  CRCW060310K0FKEA  [RESC1609X50X30NL8T20]  (value not drawn)
R15  CRCW060310K0FKEA  [RESC1609X50X30NL8T20]  (value not drawn)
R16  Resistance: 1k  [FP-CRCW0603-e3-MFG]  (hidden comment: CRCW06031K00FKEA)
R17  Resistance: 1k  [FP-CRCW0603-e3-MFG]  (hidden comment: CRCW06031K00FKEA)
SW2  PEC11R-4215F-S0024  [BOUR-PEC11R-4XXXF-SXXXX_V]
U3  SN74LVC2G34DRLR  [FP-DRL0006A-MFG]

### Blocks framed on the sheet
Rotary Encoder: C22 C23 R11-R15 SW2
LCD: C24 C25 J6
Tx/Rx LEDS: D3 D4 R16 R17

### Ports
Encoder (out, harness *), RX_LED (in), SCL (bidir), SDA (bidir), TRIG_IN_BUF (out), TRIG_OUT (in), TX_LED (in)

### Harnesses
*: Encoder_A, Encoder_B, Encoder_push_button

### Nets
+5V: C24.2 C25.2 C26.1 C27.2 J6.2 R11.2 R12.2 R13.2 R16.1 R17.1 U3.5(VCC)
GND: C22.2 C23.2 C24.1 C25.1 C26.2 C27.1 J6.1 J7.2 J7.3(MNT_1) J7.4(MNT_2) J8.2 J8.3(MNT_1) J8.4(MNT_2) SW2.2 SW2.4(COM) SW2.6(SHLD1) SW2.7(SHLD2) U3.2(GND)
Encoder_A: C22.1 R14.2 ; port Encoder.Encoder_A
Encoder_B: C23.1 R15.2 ; port Encoder.Encoder_B
Encoder_push_button: R13.1 SW2.1 ; port Encoder.Encoder_push_button
RX_LED: D4.1(C) ; port RX_LED
SCL: J6.4 ; port SCL
SDA: J6.3 ; port SDA
TRIG_IN: J7.1 U3.1(1A)
TRIG_IN_BUF: U3.6(1Y) ; port TRIG_IN_BUF
TRIG_OUT: U3.3(2A) ; port TRIG_OUT
TRIG_OUT_BUF: J8.1 U3.4(2Y)
TX_LED: D3.1(C) ; port TX_LED
NetD3_2: D3.2(A) R16.2
NetD4_2: D4.2(A) R17.2
NetR11_1: R11.1 R15.1 SW2.3(B)
NetR12_1: R12.1 R14.1 SW2.5(A)

### Notes on the sheet
- LCD being considered:
  https://www.sunfounder.com/products/i2c-lcd2004-module
  Has 16 pins but also comes with adapter which just has 4
- (near R11) 10k
- (near R12) 10k
- (near R13) 10k
- (near R14) 10k
- (near R15) 10k
- BNC I/P O/P
- (near J7) Input
- Output
- of
- Samuel Jellard
- (in symbol CMP-1747-00012-1) CW

### Library data of the parts
C22 C23 = CMP-03422-000327-1: Surface Mount Ceramic Multilayer Capacitor 0.01uF 10% X7R 25V 0603 Paper T/R; Manufacturer: YAGEO; Tolerance: 0.1; Temperature Coefficient: 15%; Lead Free: Yes; Material: Ceramic; Temperature Range Low: -55°C; Mouser Description: Multilayer Ceramic Capacitors MLCC - SMD/SMT 10nF 25V X7R 10%; Device Class L1: Passive Components; RoHS: TRUE; Digikey Description: CAP CER 10000PF 25V X7R 0603; Capacitance: 10 nF; Temperature: -55°C to +125°C; Footprint Url: http://www.yageo.com/exep/pages/download/literatures/UPY-C_GEN_24.pdf; Category: Cap; ComponentLink2URL: http://www.yageo.com/documents/recent/UPY-GPHC_X7R_6.3V-to-50V_18.pdf; Octopart: https://octopart.com/cc0603krx7r8bb103-yageo-9288195; Temperature Characteristic: X7R; ComponentLink2Description: Datasheet; Voltage Rating: 25 V; Package: CC0603-DA; Automotive: No; Voltage: 25 V; Device Class L3: Ceramic Capacitors; Manufacturer Part Number: CC0603KRX7R8BB103; Device Class L2: Capacitors; Temperature Range High: +125°C; Height: 0.9mm
C24 = CMP-1035-02797-1: as C10 on sheet uC; Technology: SMT; Max Thickness: 1 mm; Rated Voltage: 6.3 V
C25 C27 = CMP-2006-03061-2: as C3 on sheet uC; Temperature: -55°C to +125°C; RoHS: TRUE; Material: Ceramic; Temperature Range High: +125°C; Lead Free: Yes; Octopart: https://octopart.com/c0603c104k5ractu-kemet-139244; Digikey Description: CAP CER 0.1UF 50V X7R 0603; Category: Cap; Package: C0603C-CF; ComponentLink2Description: Datasheet; Temperature Range Low: -55°C; Device Class L1: Passive Components; Automotive: Yes; Device Class L3: Ceramic Capacitors; ComponentLink2URL: https://api.kemet.com/component-edge/download/datasheet/C0603C100J5GACAUTO.pdf; Capacitance: 0.10 μF; Device Class L2: Capacitors; Manufacturer Part Number: C0603C104K5RACTU; Temperature Characteristic: X7R; Height: 0.87mm
C26 = CMP-03422-000924-1: as C5 on sheet uC; Package: CC0603-DA; RoHS: TRUE; Device Class L2: Capacitors; Temperature Characteristic: X7R; Temperature: -55°C to +125°C; Temperature Range Low: -55°C; Automotive: No; ComponentLink2Description: Datasheet; Lead Free: Yes; Capacitance: 1 uF; ComponentLink2URL: http://www.yageo.com/documents/recent/UPY-GPHC_X7R_6.3V-to-50V_18.pdf; Device Class L1: Passive Components; Octopart: https://octopart.com/cc0603krx7r7bb105-yageo-42271928; Category: Cap; Digikey Description: CAP CER 1UF 16V X7R 0603; Footprint Url: http://www.yageo.com/exep/pages/download/literatures/UPY-C_GEN_24.pdf; Height: 0.9mm; Manufacturer Part Number: CC0603KRX7R7BB105; Material: Ceramic; Voltage Rating: 16 V; Temperature Range High: +125°C; Mouser Description: Multilayer Ceramic Capacitor, CC Series, 1 - F, - 10%, X7R, 16 V, 0603 [1608 Metric]; Device Class L3: Ceramic Capacitors
D3 D4 = CMP-22017-000008-1: LED Uni-Color Blue 468nm 2-Pin Chip LED T/R / LED BLUE CLEAR 0603 SMD; Lens Color: Colorless; Dominant Wavelength: 475nm; Forward Current: 20mA; Viewing Angle: 130°; Power Dissipation: 76mW; Luminous Intensity: 180mcd; Reverse Voltage: 5V; Number of Elements: 1; Lens Style: Diffused; Forward Voltage: 3.8V; Max Power Dissipation: 75mW; Case Code (Metric): 1608; Packaging: Tape and Reel; Case/Package: 0603; Depth: 1.6mm; Mount: Surface Mount; Lead Free: Lead Free; Wavelength: 468nm; Min Operating Temperature: -20°C; Lens Transparency: Clear; Illumination Color: Blue; Height: 0.55mm; Test Current: 20mA; Case Code (Imperial): 0603; Max Operating Temperature: 80°C; Number of Pins: 2; Length: 0.8mm; Radiation Hardening: No; Package Quantity: 1; Number of LEDs: 1; Width: 0.8mm; Color: Blue
J6 = 56792406a6bd5c25e158f553ecd1aa7: CONN HEADER VERT 4POS 1.27MM; Pitch: 0.05inch; Number of Positions: 4; Contact Type: Female Socket; Lead Free: Lead Free; Mount: Through Hole; RoHS Compliant: Yes; Package Quantity: 1; Termination: Solder; Contact Plating: Gold; Connector Type: Header; Number of Rows: 1; Packaging: Bulk
J7 J8 = CMP-20040-000002-1: CONN BNC RCPT R/A 50 OHM PCB; Manufacturer: Amphenol RF; Impedance: 50Ω; Number Of Contacts: 2; Pitch: 2.54mm; Dielectric Material: Polypropylene; Is Female: yes; Frequency: 1GHz; Conn Orientation: Right Angle; Lead Free: Yes; Device Class L2: RF / Coaxial Connectors; Digikey Description: CONN BNC RCPT R/A 50 OHM PCB; Octopart: https://octopart.com/031-5540-amphenol+rf-49742301; ComponentLink2URL: https://www.amphenolrf.com/downloads/dl/file/id/2040/product/579/031_5540_customer_drawing.pdf; Package: 0; Automotive: No; Temperature: -55°C to +85°C; Contact Material: Gold,Nickel; RoHS: TRUE; ComponentLink2Description: Datasheet; Height: 13.4mm; Category: Conn; Manufacturer Part Number: 031-5540; Temperature Range High: +85°C; Device Class L3: unset; Temperature Range Low: -55°C; Device Class L1: Connectors
R11-R15 = CMP-1666-00005-4: as R4 on sheet uC; Max Operating Temperature: 155 degC; PackageDescription: 2-Pin Surface Mount Device, Body 1.575 x 0.85 mm; ComponentLink1Description: Manufacturer URL; RoHSCompliant: true; PackageReference: 0603; REACH SVHC: Unknown; Length: 1.55 mm; DatasheetVersion: 06/2012; Packaging: Tape and Reel; Min Operating Temperature: -55 degC; Mounting Technology: Surface Mount; ComponentLink2URL: https://datasheet.ciiva.com/11809/0900766b80d98afc-11809037.pdf; Height: 0.45 mm; ComponentLink2Description: Datasheet; Package Quantity: 5000; ComponentLink1URL: http://www.vishay.com/
R16 R17 = CMP-1666-00003-5: RES Thick Film, 1kΩ, 1%, 0.1W, 100ppm/°C, 0603; Max Power Dissipation: 100mW; Voltage Rating: 75V; Max Operating Temperature: 155°C; Number of Pins: 2; Case Code (Imperial): 0603; Width: 0.033inch; Power Rating: 100mW; Number of Terminations: 2; Package Quantity: 10; Weight: 7.1E-05oz; Tolerance: 1%; Temperature Coefficient: 100ppm/°C; Military Standard: Not; Mount: Surface Mount; Voltage Rating (DC): 75V; Depth: 0.85mm; Composition: Thick Film; Radiation Hardening: No; Termination: SMD/SMT; Length: 1.55mm; Case Code (Metric): 1608; Contact Plating: Tin; Min Operating Temperature: -55°C; Packaging: Tape and Reel; Height: 0.45mm; Lead Free: Lead Free; Case/Package: 0603; Features: Automotive AEC-Q200
SW2 = CMP-1747-00012-1: 12 mm Incremental Encoder, 24 Detent, -30 to 70 degC, 5-Pin THD, RoHS, Bulk; Case\Package: Axial; Power Rating: 250 mW; Voltage Rating: 250 V; Tolerance: 1%; Resistance: 100 kohm; Mount: Through Hole; Package Quantity: 200; ComponentLink2Description: Datasheet; Max Operating Temperature: 155 degC; Length: 0.248 inch; Packaging: Bulk; ComponentLink2URL: http://www.bourns.com/docs/Product-Datasheets/PEC11R.pdf; Min Operating Temperature: -55 degC; DatasheetVersion: Jul-14; ComponentLink1Description: Manufacturer URL; RoHSCompliant: true; PackageDescription: 5-Pin Through Hole Device, Body 12.5 x 13.4 mm; PackageReference: PEC11R-4XXXF-SXXXX; ComponentLink1URL: http://www.bourns.com/
U3 = CMP-0859-00812-4: IC BUFFER NON-INVERT 5.5V 6SOT; Number of Bits per Element: 1; Number of Bits: 2; Low Level Output Current: 32mA; Polarity: Non-Inverting; Min Supply Voltage: 1.65V; Propagation Delay: 8.6ns; High Level Output Current: -32mA; Quiescent Current: 10uA; Contact Plating: Gold; Case/Package: SOT; Technology: CMOS; Min Operating Temperature: -40°C; Number of Elements: 2; REACH SVHC: No SVHC; Number of Channels: 2; Series: 74LVC; Number of Pins: 6; Mount: Surface Mount; Logic Function: Buffer; Number of Output Lines: 2; Packaging: Tape and Reel; Package Quantity: 4000; Radiation Hardening: No; Number of Gates: 2; Turn-On Delay Time: 8.6ns; Max Operating Temperature: 125°C; Max Supply Voltage: 5.5V; Lead Free: Lead Free; RoHS Compliant: Yes; Number of Outputs: 2; Number of Inputs: 2; Number of Input Lines: 2

## Sheet Power.SchDoc
size A4; SheetNumber: 3; SheetTotal: 6
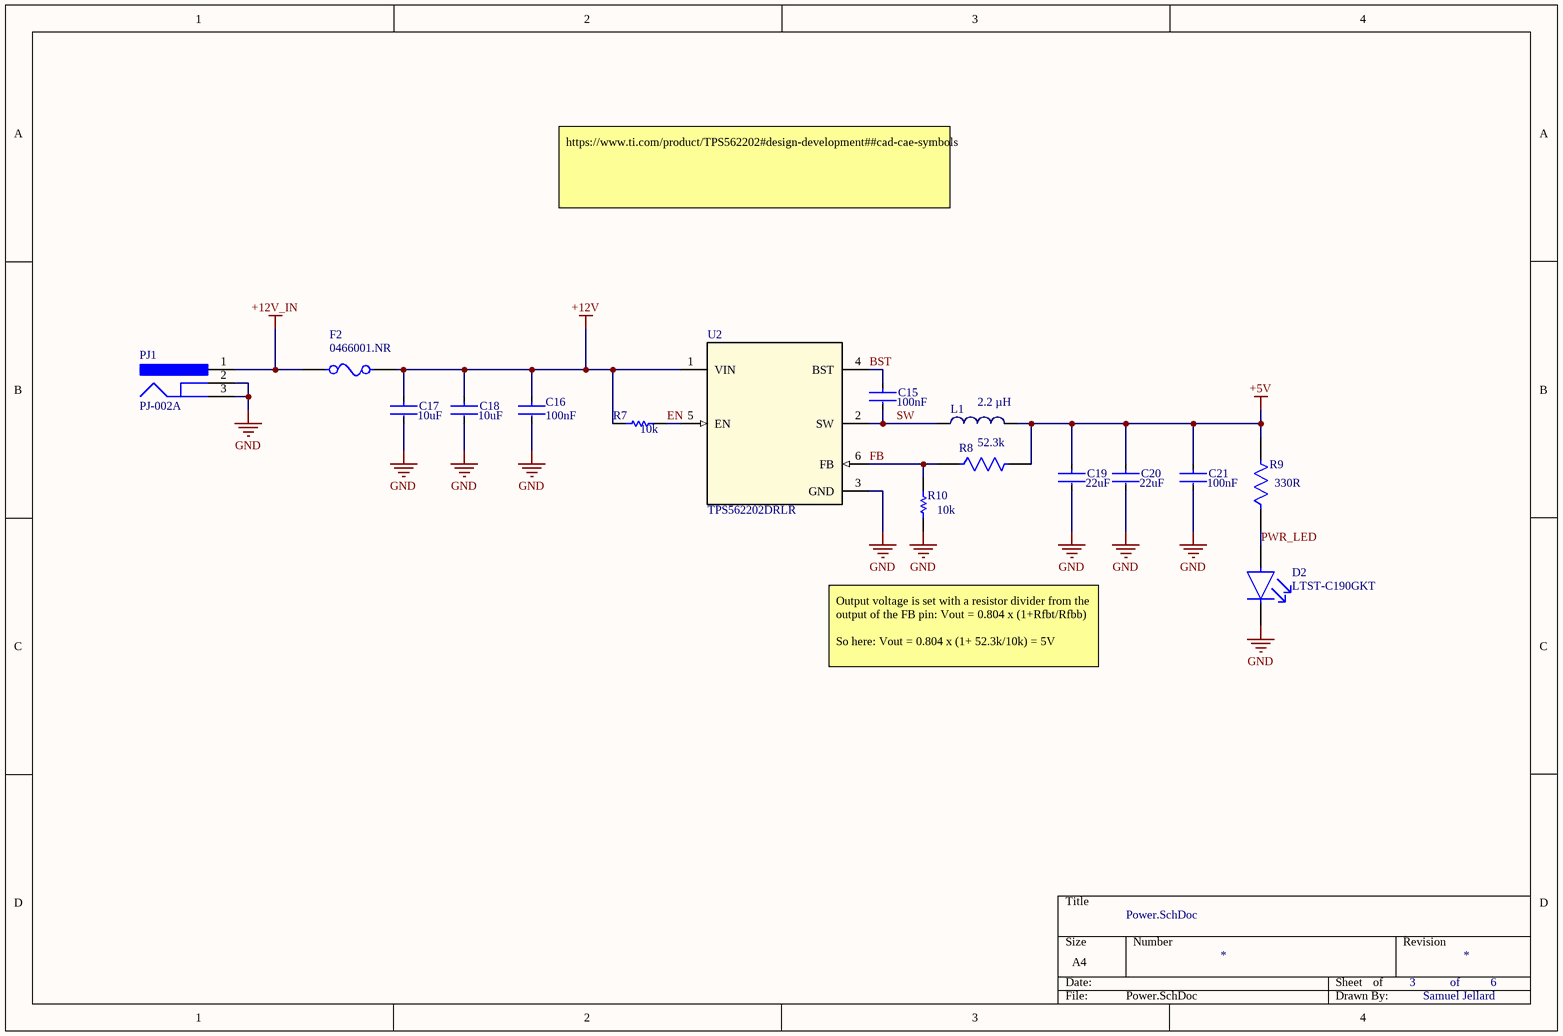
[diagram p4: Power.SchDoc]

### Parts
C15  Capacitance: 100nF  [FP-C1608-080-0_1-IPC_B]  (hidden comment: C1608X7R1E104K080AA)
C16  Capacitance: 100nF  [FP-C1608-080-0_1-IPC_B]  (hidden comment: C1608X7R1E104K080AA)
C17  Capacitance: 10uF  [FP-GRM21B-0_15-IPC_A]  (hidden comment: GRM21BR61E106MA73L)
C18  Capacitance: 10uF  [FP-GRM21B-0_15-IPC_A]  (hidden comment: GRM21BR61E106MA73L)
C19  Capacitance: 22uF  [FP-GRM21B-0_2-e0_2_0_7-IPC_C]  (hidden comment: GRM21BR61A226ME44)
C20  Capacitance: 22uF  [FP-GRM21B-0_2-e0_2_0_7-IPC_C]  (hidden comment: GRM21BR61A226ME44)
C21  Capacitance: 100nF  [FP-C1608-080-0_1-IPC_B]  (hidden comment: C1608X7R1E104K080AA)
D2  LTST-C190GKT  [FP-LTST-C190GKT-MFG]
F2  0466001.NR  [FP-0466-MFG]
L1  Inductance: 2.2 µH  [WE-LHMI 7050]  (hidden comment: 74437349022)
PJ1  PJ-002A  [CUI-PJ-002A_V]
R7  CRCW060310K0FKEA  [RESC1609X50X30NL8T20]  (value not drawn)
R8  CRCW060352K3FKEA  [FP-CRCW0603-e3-IPC_B]  (value not drawn)
R9  Resistance: 330R  [FP-CRCW0603-e3-IPC_B]  (hidden comment: CRCW0603330RFKEA)
R10  CRCW060310K0FKEA  [RESC1609X50X30NL8T20]  (value not drawn)
U2  TPS562202DRLR  [DRL0006A]

### Nets
+5V: C19.1 C20.1 C21.2 L1.2 R8.2 R9.2
+12V: C16.2 C17.1 C18.1 F2.2 R7.1 U2.1(VIN)
+12V_IN: F2.1 PJ1.1
GND: C16.1 C17.2 C18.2 C19.2 C20.2 C21.1 D2.1(C) PJ1.2 PJ1.3 R10.1 U2.3(GND)
BST: C15.2 U2.4(BST)
EN: R7.2 U2.5(EN)
FB: R8.1 R10.2 U2.6(FB)
PWR_LED: D2.2(A) R9.1
SW: C15.1 L1.1 U2.2(SW)

### Notes on the sheet
- https://www.ti.com/product/TPS562202#design-development##cad-cae-symbols
- (near R7) 10k
- 52.3k
- (near R10) 10k
- Output voltage is set with a resistor divider from the output of the FB pin: Vout = 0.804 x (1+Rfbt/Rfbb)
  So here: Vout = 0.804 x (1+ 52.3k/10k) = 5V
- of
- Samuel Jellard

### Library data of the parts
C15 C16 C21 = CMP-2000-05395-2: Multilayer Ceramic Capacitors 100nF ±10% 25V X7R SMD 0603; Lead Free: Lead Free; REACH SVHC: No SVHC; Tolerance: 10%; Case Code (Metric): 1608; Packaging: Tape and Reel; Radiation Hardening: No; Dielectric: X7R; Height: 0.8mm; Width: 0.031inch; Voltage Rating (DC): 25V; Case Code (Imperial): 0603; Mount: Surface Mount; RoHS Compliant: Yes; Depth: 0.8mm; Min Operating Temperature: -55°C; Number of Pins: 2; Weight: 7.1E-05oz; Max Operating Temperature: 125°C; Dielectric Material: Ceramic; Resistor Type: Ceramic; Construction: Flat; Thickness: 0.037inch; Package Quantity: 1; Voltage Rating: 25V; Series: C; Voltage: 25V; Case/Package: 0603; Termination: SMD/SMT; Length: 1.6mm
C17 C18 = CMP-06035-013048-1: Chip Multilayer Ceramic Capacitors for General Purpose, 0805, 10uF, X5R, 15%, 20%, 25V; Max Operating Temperature: 85°C; Package Quantity: 3000; Case/Package: 0805; Depth: 1.25mm; Case Code (Imperial): 0805; Termination: SMD/SMT; Width: 0.049inch; Packaging: Tape and Reel; Tolerance: 20%; Height: 1.25mm; Min Operating Temperature: -55°C; Weight: 0.000335oz; Voltage Rating (DC): 25V; Dielectric: X5R; Length: 2mm; Thickness: 0.055inch; Voltage Rating: 25V; Resistor Type: Ceramic; Lead Free: Lead Free; Case Code (Metric): 2012; Mount: Surface Mount; REACH SVHC: No SVHC
C19 C20 = CMP-06035-039918-1: Chip Multilayer Ceramic Capacitors for General Purpose, 0805, 22uF, X5R, 15%, 20%, 10V; Dissipation Factor: 0.035%; Min Operating Temperature: -55°C; Voltage Rating (DC): 10V; Height: 1.25mm; Depth: 1.25mm; Max Operating Temperature: 85°C; Width: 1.25mm; Lead Free: Lead Free; Dielectric Material: Ceramic; Weight: 0.000335oz; Tolerance: 20%; Voltage Rating: 10V; Case Code (Metric): 2012; Termination: SMD/SMT; Length: 2mm; Thickness: 0.057inch; Case/Package: 0805; Packaging: Tape and Reel; Voltage: 10V; Case Code (Imperial): 0805; Resistor Type: Ceramic; Package Quantity: 3000; Mount: Surface Mount; Dielectric: X5R
D2 = CMP-22017-000005-2: LED Uni-Color Green 565nm 2-Pin Chip LED T/R; Dominant Wavelength: 569nm; Reverse Voltage: 5V; Lens Style: Clear; Lens Color: Colorless; Viewing Angle: 130°; Voltage: 2V; Forward Current: 30mA; Power Dissipation: 100mW; Luminous Intensity: 6mcd; Number of LEDs: 1; Forward Voltage: 2.1V; Test Current: 10mA; Min Operating Temperature: -55°C; Mount: Surface Mount; Width: 0.8mm; Packaging: Tape and Reel; Lens Transparency: Clear; Case Code (Metric): 1608; Depth: 0.8mm; Case Code (Imperial): 0603; Case/Package: 0603; Number of Pins: 2; Max Operating Temperature: 85°C; Lead Free: Lead Free; Wavelength: 565nm; Number of Elements: 1; Length: 1.6mm; Height: 0.8mm; Package Quantity: 1; Power Rating: 100mW; Radiation Hardening: No; Illumination Color: Green; Color: Green
F2 = CMP-08605-000058-1: FUSE BOARD MNT 1A 63VAC/VDC 1206; Manufacturer: Littelfuse Inc; Max Fuse Dc Voltage: 63V; Fuse Interrupt Ac Current: 50A; Fuse Voltage Drop: 79.97mV; Resistance: 0.075Ω; Value: 0.075Ω; Fuse I2T: 0.0423A2Sec; Fuse Blow Speed: Fast; Temperature Range High: +90°C; Max Fuse Ac Voltage: 63V; Manufacturer Part Number: 0466001.NR; Package: 0466; ComponentLink2URL: https://www.littelfuse.com/~/media/electronics/datasheets/fuses/littelfuse_fuse_466_datasheet.pdf.pdf; Device Class L3: unset; Lead Free: Yes; Automotive: No; Digikey Description: FUSE BOARD MNT 1A 63VAC/VDC 1206; Height: 0.66mm; Temperature Range Low: -55°C; Category: Fuse; ComponentLink2Description: Datasheet; Device Class L1: Circuit Protection; Device Class L2: Fuses; Fuse Current: 1A; Mouser Description: Surface Mount Fuses 63V FA 1206 1A VFA Slimline; Octopart: https://octopart.com/0466001.nr-littelfuse-566005; Fuse Interrupt Dc Current: 50A; RoHS: TRUE; Voltage Rating: 63V; Temperature: -55°C to +90°C
L1 = CMP-1353-00064-1: SMD Power Inductor WE-LHMI, L=2.2 µH; Manufacturer: Wuerth Elektronik; ComponentLink1Description: Manufacturer URL; ComponentLink2Description: Datasheet; PartNumber: 74437349022; ComponentLink2URL: http://katalog.we-online.de/kataloge/eisos/media/pdf/74437349022.pdf; ComponentLink1URL: http://www.we-online.com; PackageReference: WE-LHMI 7050
PJ1 = CMP-2000-06895-1: Through Hole Right Angle DC Power Jack, 2.5 A, 2 mm Center Pin, 3 Position, -25 to 85 degC, RoHS, Bulk; Manufacturer: CUIInc.; Current Rating: 2.5A; Inside Contact Diameter: 2mm; Insulation Resistance: 50MOhms; Outside Contact Diameter: 6.5mm; Voltage Rating: 24V; Brand: CUI; Operating Temperature Range: -25Cto+85C; Mounting Technology: ThroughHole; Connector Type: DCPowerJack; Contact Material: Copper; Datasheet URL: http://www.cui.com/product/resource/pj-002a.pdf; Contact Gender: Male; Housing Material: PolybutyleneTerephthalate(PBT); Manufacturer URL: http://www.cui.com/; Package Reference: PJ-002A; Mounting Style: ThroughHole; Mounting Angle: Right; Product Category: DCPowerConnectors; Product: Jacks; Flammability Rating: UL94V-0; Contact Plating: Nickel; RoHS: True; Datasheet Version: Rev. 1.03, 04/2016; Package Description: 3-Pin Through Hole Device, Body 14.4 x 9 mm, Height 11 mm; Factory Pack Quantity: 500; Termination Style: ThroughHole
R7 R10 = CMP-1666-00005-4: as R4 on sheet uC; Max Operating Temperature: 155 degC; PackageDescription: 2-Pin Surface Mount Device, Body 1.575 x 0.85 mm; ComponentLink1Description: Manufacturer URL; RoHSCompliant: true; PackageReference: 0603; REACH SVHC: Unknown; Length: 1.55 mm; DatasheetVersion: 06/2012; Packaging: Tape and Reel; Min Operating Temperature: -55 degC; Mounting Technology: Surface Mount; ComponentLink2URL: https://datasheet.ciiva.com/11809/0900766b80d98afc-11809037.pdf; Height: 0.45 mm; ComponentLink2Description: Datasheet; Package Quantity: 5000; ComponentLink1URL: http://www.vishay.com/
R8 = CMP-2000-03451-2: RES Thick Film, 52.3kΩ, 1%, 0.1W, 100ppm/°C, 0603; Voltage Rating: 75V; Max Power Dissipation: 100mW; Resistance: 52.3kR; Min Operating Temperature: -55°C; Number of Pins: 2; Weight: 7.1E-05oz; Case Code (Metric): 1608; Number of Terminations: 2; Radiation Hardening: No; Case Code (Imperial): 0603; Packaging: Tape and Reel; Width: 0.033inch; Length: 1.55mm; Case/Package: 0603; Tolerance: 1%; Termination: SMD/SMT; Contact Plating: Tin; Package Quantity: 10; Temperature Coefficient: 100ppm/°C; Depth: 0.85mm; Max Operating Temperature: 155°C; Features: Automotive AEC-Q200; Height: 0.45mm; Power Rating: 100mW; Composition: Thick Film; Military Standard: Not
R9 = CMP-1012-00454-3: RES Thick Film, 330Ω, 1%, 0.1W, 100ppm/°C, 0603; Voltage Rating: 75V; Max Power Dissipation: 100mW; Depth: 0.85mm; Contact Plating: Tin; Package Quantity: 10; Termination: SMD/SMT; Tolerance: 1%; Height: 0.45mm; Number of Terminations: 2; Radiation Hardening: No; Features: Automotive AEC-Q200; Case/Package: 0603; Mount: Surface Mount; Case Code (Metric): 1608; Lead Free: Lead Free; Temperature Coefficient: 100ppm/°C; Weight: 7.1E-05oz; Military Standard: Not; Packaging: Tape and Reel; Max Operating Temperature: 155°C; Voltage Rating (DC): 75V; Length: 1.55mm; Min Operating Temperature: -55°C; Composition: Thick Film; Case Code (Imperial): 0603; Width: 0.033inch; Power Rating: 100mW
U2 = TPS562202DRLR: Switching Voltage Regulators 4.3-V to 17-V input, 2-A output, synchronous step-down voltage converter 6-SOT-5X3 -40 to 150; Mfr_Name: Texas Instruments; Type: DEV; RefDes: RefDes; Copyright: Copyright (C) 2021 Ultra Librarian. All rights reserved.; Manufacturer_Part_Number: TPS562202DRLR